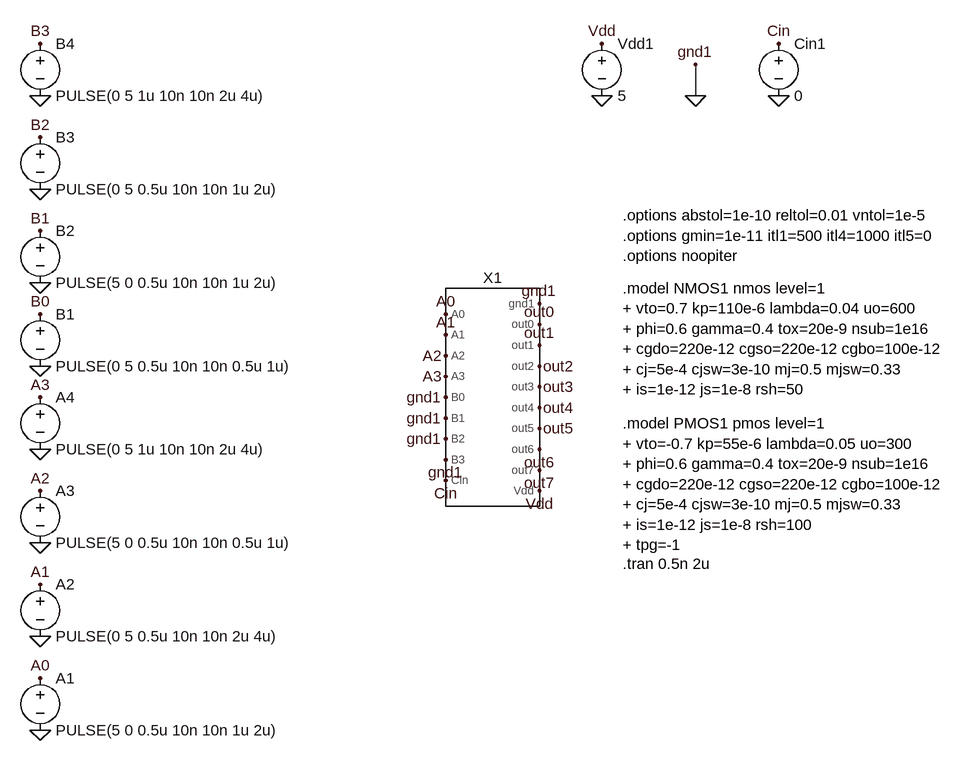
[diagram p0: schematic Draft20.asc]
Draft20.asc, the LTspice schematic file:
Version 4.1
SHEET 1 880 680
WIRE 176 -464 176 -512
FLAG -832 -464 0
FLAG -832 -176 0
FLAG -832 -48 0
FLAG -832 80 0
FLAG -832 224 0
FLAG -832 368 0
FLAG -832 512 0
FLAG 32 -464 0
FLAG 176 -464 0
FLAG 176 -512 gnd1
FLAG 304 -464 0
FLAG -832 432 A0
FLAG -832 288 A1
FLAG -832 144 A2
FLAG -832 0 A3
FLAG -832 -128 B0
FLAG -832 -256 B1
FLAG -832 -400 B2
FLAG -832 -544 B3
FLAG 304 -544 Cin
FLAG -832 -320 0
FLAG -208 -128 A0
FLAG -208 -96 A1
FLAG -208 -64 A2
FLAG -208 -32 A3
FLAG -208 128 Cin
FLAG -64 -112 out0
FLAG -64 -80 out1
FLAG -64 -48 out2
FLAG -64 -16 out3
FLAG -64 16 out4
FLAG -64 48 out5
FLAG -64 80 out6
FLAG -64 112 out7
FLAG -64 144 Vdd
FLAG -64 -144 gnd1
FLAG 32 -544 Vdd
FLAG -208 0 gnd1
FLAG -208 32 gnd1
FLAG -208 64 gnd1
FLAG -208 96 gnd1
SYMBOL AddSub -144 0 R0
SYMATTR InstName X1
SYMBOL voltage -832 416 R0
SYMATTR InstName A1
SYMATTR Value PULSE(5 0 0.5u 10n 10n 1u 2u)
SYMBOL voltage -832 272 R0
SYMATTR InstName A2
SYMATTR Value PULSE(0 5 0.5u 10n 10n 2u 4u)
SYMBOL voltage -832 128 R0
SYMATTR InstName A3
SYMATTR Value PULSE(5 0 0.5u 10n 10n 0.5u 1u)
SYMBOL voltage -832 -16 R0
SYMATTR InstName A4
SYMATTR Value PULSE(0 5 1u 10n 10n 2u 4u)
SYMBOL voltage -832 -144 R0
SYMATTR InstName B1
SYMATTR Value PULSE(0 5 0.5u 10n 10n 0.5u 1u)
SYMBOL voltage -832 -272 R0
SYMATTR InstName B2
SYMATTR Value PULSE(5 0 0.5u 10n 10n 1u 2u)
SYMBOL voltage -832 -416 R0
SYMATTR InstName B3
SYMATTR Value PULSE(0 5 0.5u 10n 10n 1u 2u)
SYMBOL voltage -832 -560 R0
SYMATTR InstName B4
SYMATTR Value PULSE(0 5 1u 10n 10n 2u 4u)
SYMBOL voltage 32 -560 R0
SYMATTR InstName Vdd1
SYMATTR Value 5
SYMBOL voltage 304 -560 R0
WINDOW 123 0 0 Left 0
WINDOW 39 0 0 Left 0
SYMATTR InstName Cin1
SYMATTR Value 0
TEXT 64 -168 Left 2 !.model NMOS1 nmos level=1\n+ vto=0.7 kp=110e-6 lambda=0.04 uo=600\n+ phi=0.6 gamma=0.4 tox=20e-9 nsub=1e16\n+ cgdo=220e-12 cgso=220e-12 cgbo=100e-12\n+ cj=5e-4 cjsw=3e-10 mj=0.5 mjsw=0.33\n+ is=1e-12 js=1e-8 rsh=50
TEXT 64 40 Left 2 !.model PMOS1 pmos level=1\n+ vto=-0.7 kp=55e-6 lambda=0.05 uo=300\n+ phi=0.6 gamma=0.4 tox=20e-9 nsub=1e16\n+ cgdo=220e-12 cgso=220e-12 cgbo=100e-12\n+ cj=5e-4 cjsw=3e-10 mj=0.5 mjsw=0.33\n+ is=1e-12 js=1e-8 rsh=100\n+ tpg=-1
TEXT 64 256 Left 2 !.tran 0.5n 2u
TEXT 64 -280 Left 2 !.options abstol=1e-10 reltol=0.01 vntol=1e-5\n.options gmin=1e-11 itl1=500 itl4=1000 itl5=0\n.options noopiter

The netlist it stands for:
* Draft20.asc
X§X1 A0 A1 A2 A3 0 0 0 0 Cin 0 out0 out1 out2 out3 out4 out5 out6 out7 Vdd AddSub  ; pins A0 A1 A2 A3 B0 B1 B2 B3 Cin gnd1 out0 out1 out2 out3 out4 out5 out6 out7 Vdd
V§A1 A0 0 PULSE(5 0 0.5u 10n 10n 1u 2u)
V§A2 A1 0 PULSE(0 5 0.5u 10n 10n 2u 4u)
V§A3 A2 0 PULSE(5 0 0.5u 10n 10n 0.5u 1u)
V§A4 A3 0 PULSE(0 5 1u 10n 10n 2u 4u)
V§B1 B0 0 PULSE(0 5 0.5u 10n 10n 0.5u 1u)
V§B2 B1 0 PULSE(5 0 0.5u 10n 10n 1u 2u)
V§B3 B2 0 PULSE(0 5 0.5u 10n 10n 1u 2u)
V§B4 B3 0 PULSE(0 5 1u 10n 10n 2u 4u)
Vdd1 Vdd 0 5
V§Cin1 Cin 0 0
.model NMOS1 nmos level=1
+ vto=0.7 kp=110e-6 lambda=0.04 uo=600
+ phi=0.6 gamma=0.4 tox=20e-9 nsub=1e16
+ cgdo=220e-12 cgso=220e-12 cgbo=100e-12
+ cj=5e-4 cjsw=3e-10 mj=0.5 mjsw=0.33
+ is=1e-12 js=1e-8 rsh=50
.model PMOS1 pmos level=1
+ vto=-0.7 kp=55e-6 lambda=0.05 uo=300
+ phi=0.6 gamma=0.4 tox=20e-9 nsub=1e16
+ cgdo=220e-12 cgso=220e-12 cgbo=100e-12
+ cj=5e-4 cjsw=3e-10 mj=0.5 mjsw=0.33
+ is=1e-12 js=1e-8 rsh=100
+ tpg=-1
.tran 0.5n 2u
.options abstol=1e-10 reltol=0.01 vntol=1e-5
.options gmin=1e-11 itl1=500 itl4=1000 itl5=0
.options noopiter
.backanno
.end